# Altium schematic sheet 03_Power_ICs.SchDoc: Power ICs (part 1 of 3)
size A; Revision: A; SheetNumber: 3; SheetTotal: 10; ECE315_Project_Name: ECE453 F23 Base Project
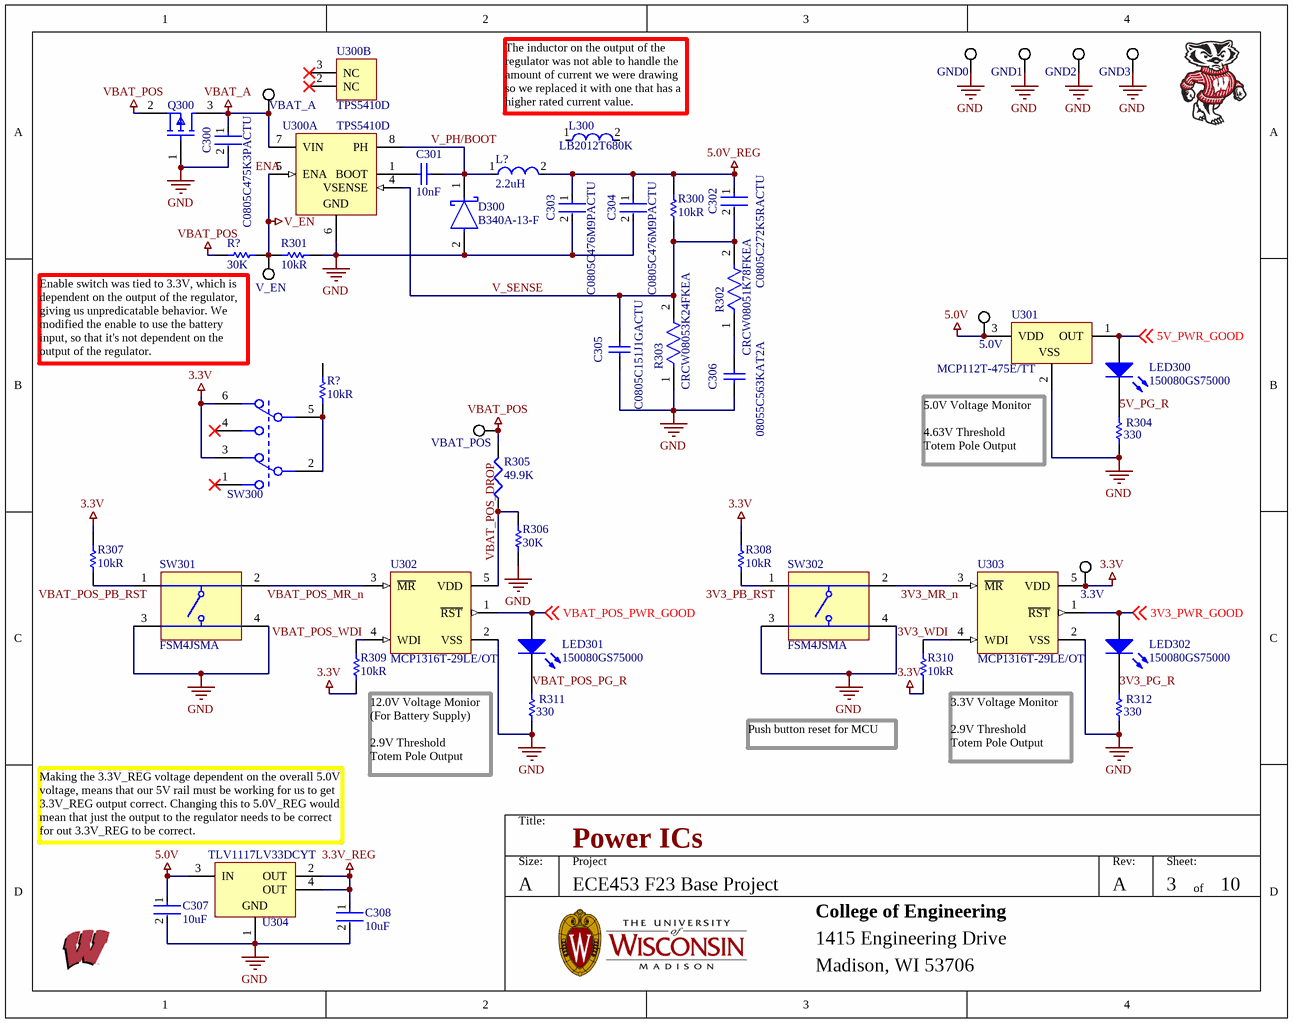
[diagram p0: 03_Power_ICs.SchDoc]

## Parts
(Parts that share a designator on the sheet are numbered #1, #2 ... from top to bottom, then left to right.)
3.3V  5019  [KSTN-5019_V]  (value not drawn)
5.0V  5019  [KSTN-5019_V]  (value not drawn)
C300  C0805C475K3PACTU  [FP-C0805C475K3PACTU-MFG]
C301  10nF  [CAP_0805]
C302  C0805C272K5RACTU  [FP-C0805C-DN-MFG]
C303  C0805C476M9PACTU  [FP-C0805C476M9PACTU-MFG]
C304  C0805C476M9PACTU  [FP-C0805C476M9PACTU-MFG]
C305  C0805C151J1GACTU  [CAPC2013X88X50NL20T25]
C306  08055C563KAT2A  [CAPC2013X94X50NL20T25]
C307  value 10uF  [FP-C0805C-DG-MFG]  (hidden comment: C0805C106K8PACTU)
C308  value 10uF  [FP-C0805C-DG-MFG]  (hidden comment: C0805C106K8PACTU)
D300  B340A-13-F  [FP-SMA-MFG]
GND0  5019  [KSTN-5019_V]  (value not drawn)
GND1  5019  [KSTN-5019_V]  (value not drawn)
GND2  5019  [KSTN-5019_V]  (value not drawn)
GND3  5019  [KSTN-5019_V]  (value not drawn)
L300  LB2012T680K  [FP-LB2012-1_25-0_2-IPC_A]
L?  Inductance: 2.2uH  [IND_TAIYO_NRS4018_TAY]  (hidden comment: NRS4018T2R2MDGJ)
LED300  150080GS75000  [0805_A]
LED301  150080GS75000  [0805_A]
LED302  150080GS75000  [0805_A]
Q300  SSM3J328R,LF  [SOT-23_M]  (value not drawn)
R300  Resistance: 10kR  [RESC2013X60X35NL10T20]  (hidden comment: RC0805FR-0710KL)
R301  Resistance: 10kR  [RESC2013X60X35NL10T20]  (hidden comment: RC0805FR-0710KL)
R302  CRCW08051K78FKEA  [FP-CRCW0805-e3-IPC_C]
R303  CRCW08053K24FKEA  [FP-CRCW0805-e3-IPC_C]
R304  Resistance: 330  [RESC2013X60X35LL10T20]  (hidden comment: RC0805FR-07330RL)
R305  49.9K  [RES_0805]
R306  30K  [RES_0805]
R307  Resistance: 10kR  [RESC2013X60X35NL10T20]  (hidden comment: RC0805FR-0710KL)
R308  Resistance: 10kR  [RESC2013X60X35NL10T20]  (hidden comment: RC0805FR-0710KL)
R309  Resistance: 10kR  [RESC2013X60X35NL10T20]  (hidden comment: RC0805FR-0710KL)
R310  Resistance: 10kR  [RESC2013X60X35NL10T20]  (hidden comment: RC0805FR-0710KL)
R311  Resistance: 330  [RESC2013X60X35LL10T20]  (hidden comment: RC0805FR-07330RL)
R312  Resistance: 330  [RESC2013X60X35LL10T20]  (hidden comment: RC0805FR-07330RL)
R?#1  30K  [RES_0805]
R?#2  Resistance: 10kR  [RESC2013X60X35NL10T20]  (hidden comment: RC0805FR-0710KL)
SW300  JS202011SCQN  [C&K_Components_0_MFG]  (value not drawn)
SW301  FSM4JSMA  [TECO-FSM4JSMA_V]
SW302  FSM4JSMA  [TECO-FSM4JSMA_V]
U300  TPS5410D  [D0008A_N]  (parts A,B of 2)
U301  MCP112T-475E/TT  [SOT-23-TT3_L]
U302  MCP1316T-29LE/OT  [SOT-23-OT5_M]
U303  MCP1316T-29LE/OT  [SOT-23-OT5_M]
U304  TLV1117LV33DCYT  [DCY0004A_M]
V_EN  5019  [KSTN-5019_V]  (value not drawn)
VBAT_A  5019  [KSTN-5019_V]  (value not drawn)
VBAT_POS  5019  [KSTN-5019_V]  (value not drawn)

## Nets
3.3V: 3.3V.1 R307.2 R308.2 R309.1 R310.1 SW300.3 SW300.6 U303.5(VDD)
3.3V_REG: C308.1 U304.2(OUT) U304.4(OUT)
5.0V: 5.0V.1 C307.1 U301.3(VDD) U304.3(IN)
5.0V_REG: C302.1 C303.1 C304.1 L?.2 R300.1
ENA: R301.1 R?#1.2 U300.5(ENA) V_EN.1  [also labelled V_EN]
GND: C300.2 C303.2 C304.2 C305.1 C306.1 C307.2 C308.2 D300.2(A) GND0.1 GND1.1 GND2.1 GND3.1 Q300.1(Gate) R301.2 R303.1 R304.1 R306.1 R311.1 R312.1 SW301.3 SW301.4 SW302.3 SW302.4 U300.6(GND) U301.2(VSS) U302.2(VSS) U303.2(VSS) U304.1(GND)
VBAT_A: C300.1 Q300.3(Drain) U300.7(VIN) VBAT_A.1
VBAT_POS: Q300.2(Source) R305.2 R?#1.1 VBAT_POS.1
3V3_MR_n: SW302.2 U303.3(~{MR})
3V3_PB_RST: R308.1 SW302.1
3V3_PG_R: LED302.1(K) R312.2
3V3_PWR_GOOD: LED302.2(A) U303.1(~{RST}) ; off-sheet 3V3_PWR_GOOD
3V3_WDI: R310.2 U303.4(WDI)
5V_PG_R: LED300.1(K) R304.2
5V_PWR_GOOD: LED300.2(A) U301.1(OUT) ; off-sheet 5V_PWR_GOOD
V_PH/BOOT: C301.2 D300.1(C) L?.1 U300.8(PH)
V_SENSE: C302.2 C305.2 R300.2 R302.2 R303.2 U300.4(VSENSE)
VBAT_POS_DROP: R305.1 R306.2 U302.5(VDD)
VBAT_POS_MR_n: SW301.2 U302.3(~{MR})
VBAT_POS_PB_RST: R307.1 SW301.1
VBAT_POS_PG_R: LED301.1(K) R311.2
VBAT_POS_PWR_GOOD: LED301.2(A) U302.1(~{RST}) ; off-sheet VBAT_POS_PWR_GOOD
VBAT_POS_WDI: R309.2 U302.4(WDI)
NetC301_1: C301.1 U300.1(BOOT)
NetC306_2: C306.2 R302.1
NetR?#2_1: R?#2.1 SW300.2 SW300.5

Not connected (* = marked no-connect by the designer): L300 1 2; R?#2 2; SW300 1* 4*; U300 2(NC)* 3(NC)*

## Notes on the sheet
- (near L300) The inductor on the output of the regulator was not able to handle the amount of current we were drawing so we replaced it with one that has a higher rated current value.
- Enable switch was tied to 3.3V, which is dependent on the output of the regulator, giving us unpredicatable behavior. We modified the enable to use the battery input, so that it's not dependent on the output of the regulator.
- (near U301) 5.0V Voltage Monitor
  4.63V Threshold
  Totem Pole Output
- (near R309) 12.0V Voltage Monior (For Battery Supply)
  2.9V Threshold
  Totem Pole Output
- (near R310) Push button reset for MCU
- 3.3V Voltage Monitor
  2.9V Threshold
  Totem Pole Output
- (near U304) Making the 3.3V_REG voltage dependent on the overall 5.0V voltage, means that our 5V rail must be working for us to get 3.3V_REG output correct. Changing this to 5.0V_REG would mean that just the output to the regulator needs to be correct for out 3.3V_REG to be correct.
- Title:
- Size:
- A
- Project
- Rev:
- Sheet:
- of
- College of Engineering
- 1415 Engineering Drive
- Madison, WI 53706